# Altium schematic sheet CH32V205CCT-R0.SchDoc
size A3; SheetNumber: 1; SheetTotal: 4
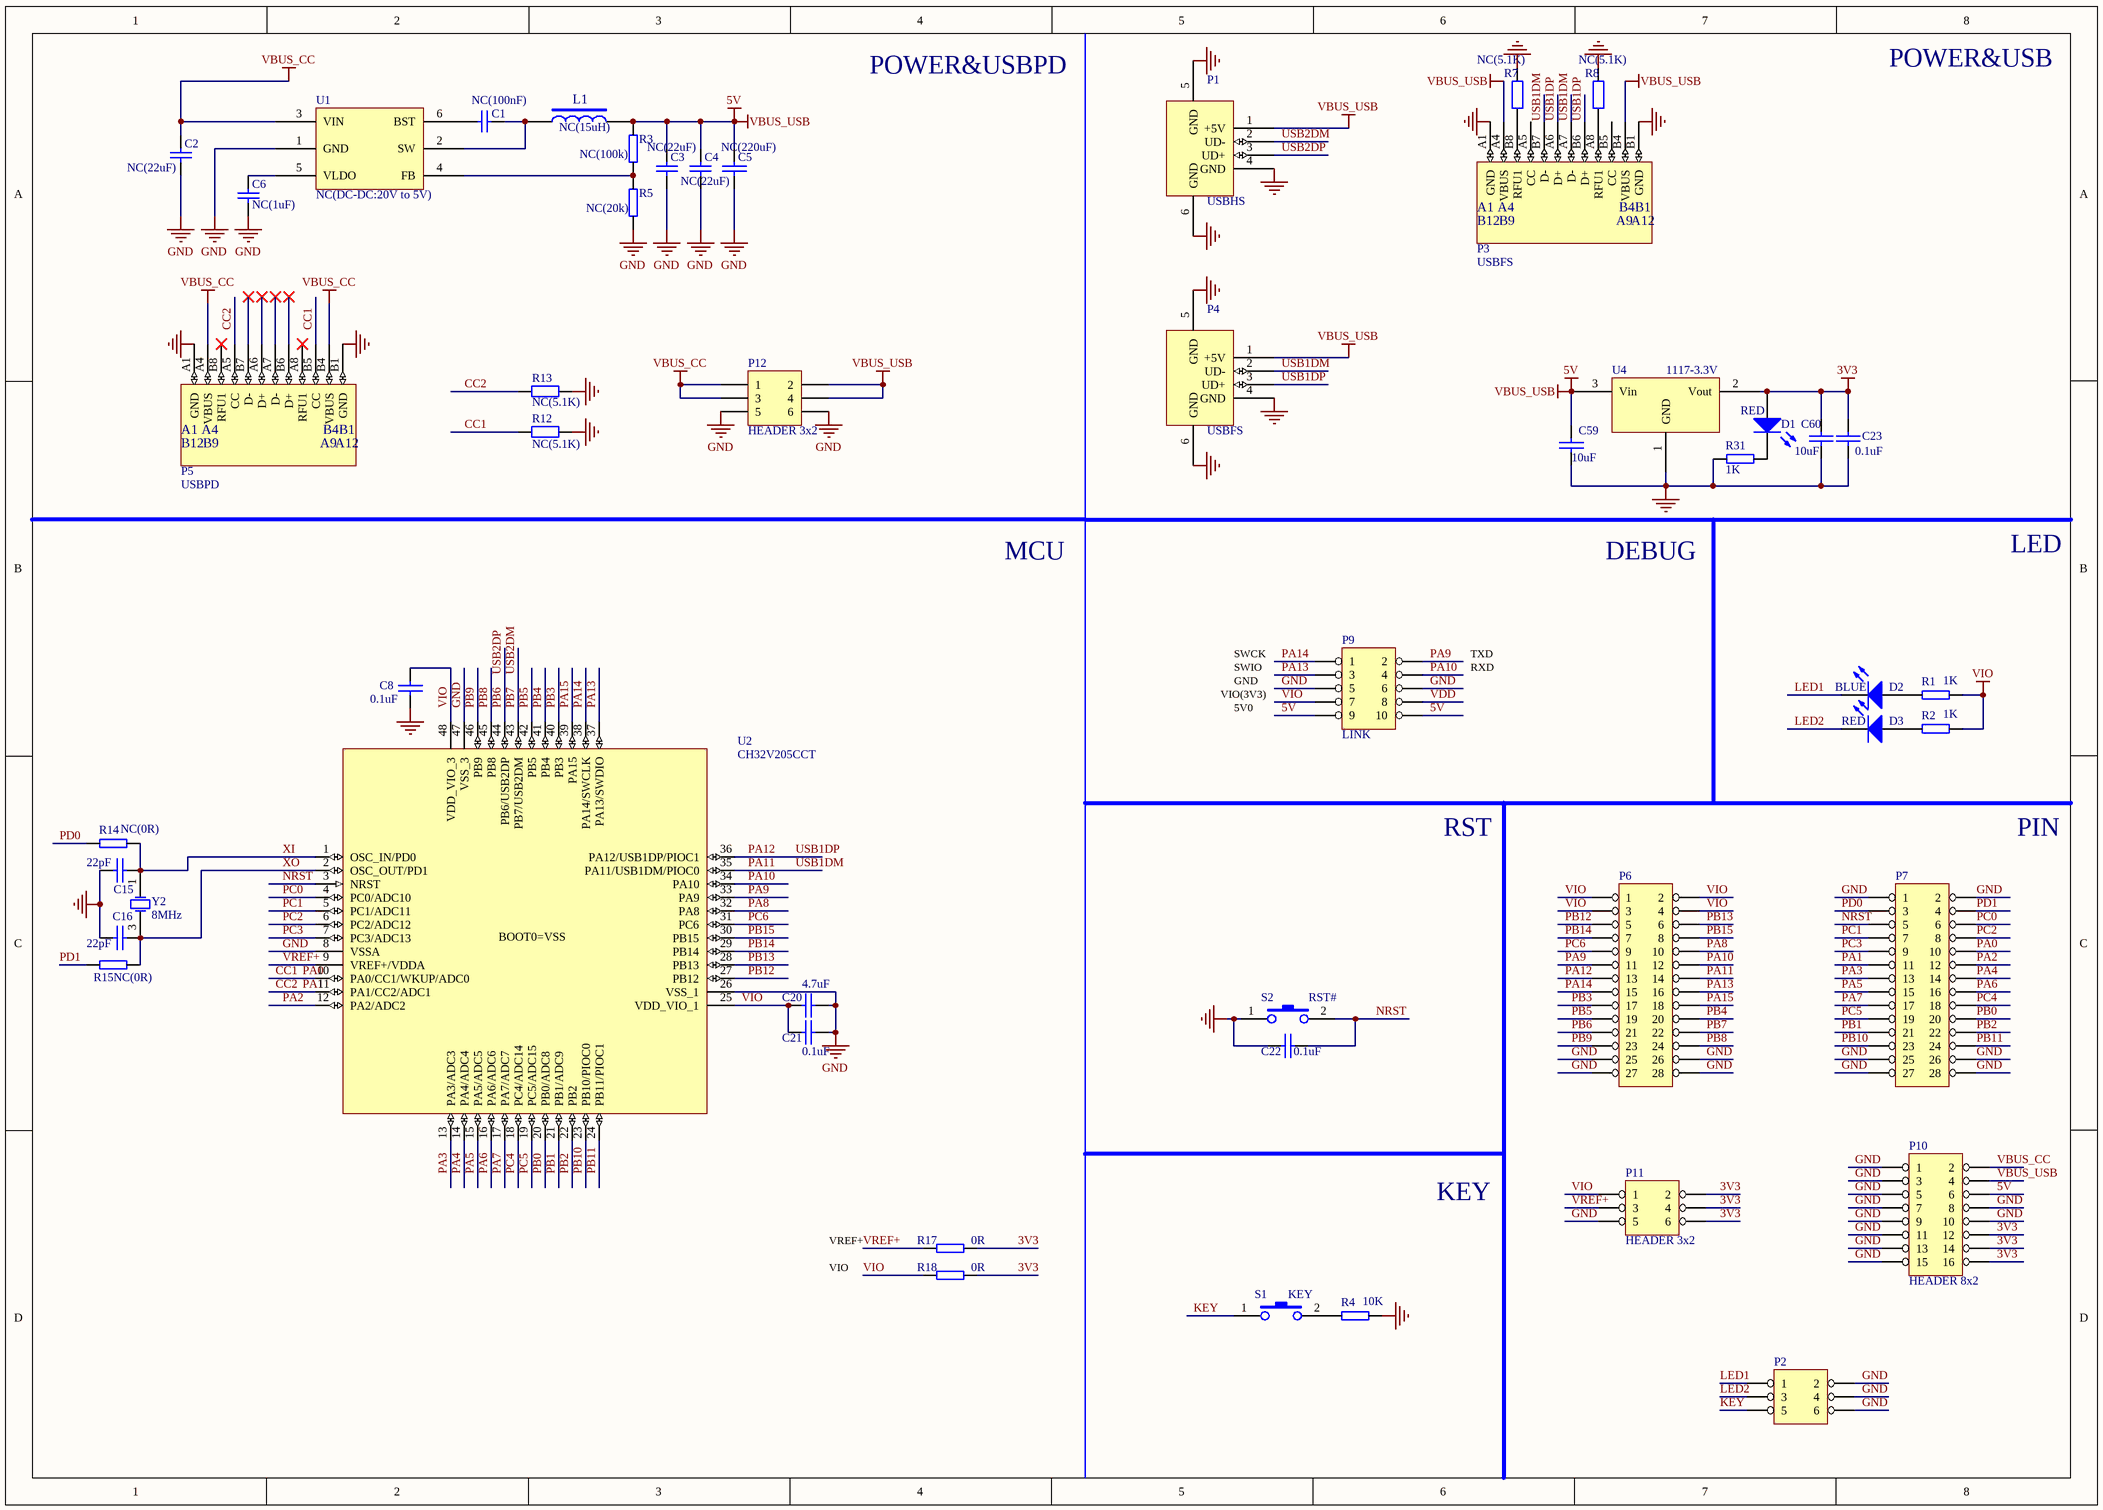
[diagram p0: CH32V205CCT-R0.SchDoc]

## Parts
C1  NC(100nF)  [0402_C]
C2  NC(22uF)  [0805_C]
C3  NC(22uF)  [0805_C]
C4  NC(22uF)  [0805_C]
C5  NC(220uF)  [CD0.1]
C6  NC(1uF)  [0402_C]
C8  0.1uF  [0603_C]
C15  22pF  [0603_C]
C16  22pF  [0603_C]
C20  4.7uF  [0603_C]
C21  0.1uF  [0603_C]
C22  0.1uF  [0603_C]
C23  0.1uF  [0402_C]
C59  10uF  [0603_C]
C60  10uF  [0603_C]
D1  RED  [0603+]
D2  BLUE  [0603+]
D3  RED  [0603+]
L1  NC(15uH)  [SMD_6x6mm]
P1  USBHS  [USBAF]
P2  IO  [IDC6-2.54mm]  (value not drawn)
P3  USBFS  [TYPE-C-Receptacle-2.0]
P4  USBFS  [USBAF]
P5  USBPD  [TYPE-C-Receptacle-2.0]
P6  (no value)  [IDC28-2.54MM]
P7  (no value)  [IDC28-2.54MM]
P9  LINK  [IDC10-2.54mm]
P10  HEADER 8x2  [IDC16-2.54mm]
P11  HEADER 3x2  [IDC6-2.54mm]
P12  HEADER 3x2  [IDC6-2.54mm]
R1  1K  [0603]
R2  1K  [0603]
R3  NC(100k)  [0603]
R4  10K  [0603]
R5  NC(20k)  [0603]
R7  NC(5.1K)  [0402]
R8  NC(5.1K)  [0402]
R12  NC(5.1K)  [0402]
R13  NC(5.1K)  [0402]
R14  NC(0R)  [0603]
R15  NC(0R)  [0603]
R17  0R  [0603]
R18  0R  [0603]
R31  1K  [0402]
S1  KEY  [SMD_6.1x3.65x2.5mm-KEY]
S2  RST#  [SMD_6.1x3.65x2.5mm-KEY]
U1  NC(DC-DC:20V to 5V)
U2  CH32V205CCT  [LQFP48]
U4  1117-3.3V  [SOT-223]
Y2  8MHz  [XT3225]

## Nets
3V3: C23.1 C60.1 D1.1(A) P10.12 P10.14 P10.16 P11.2 P11.4 P11.6 R17.1 R18.1 U4.2(Vout)
5V: C3.2 C4.2 C5.1 C59.1 L1.2 P1.1(+5V) P3.A4(VBUS) P3.B4(VBUS) P4.1(+5V) P9.9 P9.10 P10.4 P10.6 P12.2 P12.4 R3.2 U4.3(Vin)  [also labelled VBUS_USB]
GND: C2.1 C3.1 C4.1 C5.2 C6.1 C8.1 C15.1 C16.1 C20.1 C21.1 C22.1 C23.2 C59.2 C60.2 P1.4(GND) P1.5(GND) P1.6(GND) P2.2 P2.4 P2.6 P3.A1(GND) P3.B1(GND) P4.4(GND) P4.5(GND) P4.6(GND) P5.A1(GND) P5.B1(GND) P6.25 P6.26 P6.27 P6.28 P7.1 P7.2 P7.25 P7.26 P7.27 P7.28 P9.5 P9.6 P10.1 P10.3 P10.5 P10.7 P10.8 P10.9 P10.10 P10.11 P10.13 P10.15 P11.5 P12.5 P12.6 R4.1 R5.1 R7.2 R8.2 R12.2 R13.2 R31.1 S2.1 U1.1(GND) U2.8(VSSA) U2.26(VSS_1) U2.47(VSS_3) U4.1(GND)
VBUS_CC: C2.2 P5.A4(VBUS) P5.B4(VBUS) P10.2 P12.1 P12.3 U1.3(VIN)
VIO: C8.2 C20.2 C21.2 P6.1 P6.2 P6.3 P6.4 P9.7 P11.1 R1.1 R2.1 R18.2 U2.25(VDD_VIO_1) U2.48(VDD_VIO_3)
CC1: P5.B5(CC) P7.10 R12.1 U2.10(PA0/CC1/WKUP/ADC0)  [also labelled PA0]
CC2: P5.A5(CC) P7.11 R13.1 U2.11(PA1/CC2/ADC1)  [also labelled PA1]
KEY: P2.5 S1.1
LED1: D2.2(K) P2.1
LED2: D3.2(K) P2.3
NRST: C22.2 P7.5 S2.2 U2.3(NRST)
PA2: P7.12 U2.12(PA2/ADC2)
PA3: P7.13 U2.13(PA3/ADC3)
PA4: P7.14 U2.14(PA4/ADC4)
PA5: P7.15 U2.15(PA5/ADC5)
PA6: P7.16 U2.16(PA6/ADC6)
PA7: P7.17 U2.17(PA7/ADC7)
PA8: P6.10 U2.32(PA8)
PA9: P6.11 P9.2 U2.33(PA9)
PA10: P6.12 P9.4 U2.34(PA10)
PA11: P3.A7(D-) P3.B7(D-) P4.2(UD-) P6.14 U2.35(PA11/USB1DM/PIOC0)  [also labelled USB1DM]
PA12: P3.A6(D+) P3.B6(D+) P4.3(UD+) P6.13 U2.36(PA12/USB1DP/PIOC1)  [also labelled USB1DP]
PA13: P6.16 P9.3 U2.37(PA13/SWDIO)
PA14: P6.15 P9.1 U2.38(PA14/SWCLK)
PA15: P6.18 U2.39(PA15)
PB0: P7.20 U2.20(PB0/ADC8)
PB1: P7.21 U2.21(PB1/ADC9)
PB2: P7.22 U2.22(PB2)
PB3: P6.17 U2.40(PB3)
PB4: P6.20 U2.41(PB4)
PB5: P6.19 U2.42(PB5)
PB6: P1.3(UD+) P6.21 U2.44(PB6/USB2DP)  [also labelled USB2DP]
PB7: P1.2(UD-) P6.22 U2.43(PB7/USB2DM)  [also labelled USB2DM]
PB8: P6.24 U2.45(PB8)
PB9: P6.23 U2.46(PB9)
PB10: P7.23 U2.23(PB10/PIOC0)
PB11: P7.24 U2.24(PB11/PIOC1)
PB12: P6.5 U2.27(PB12)
PB13: P6.6 U2.28(PB13)
PB14: P6.7 U2.29(PB14)
PB15: P6.8 U2.30(PB15)
PC0: P7.6 U2.4(PC0/ADC10)
PC1: P7.7 U2.5(PC1/ADC11)
PC2: P7.8 U2.6(PC2/ADC12)
PC3: P7.9 U2.7(PC3/ADC13)
PC4: P7.18 U2.18(PC4/ADC14)
PC5: P7.19 U2.19(PC5/ADC15)
PC6: P6.9 U2.31(PC6)
PD0: P7.3 R14.1
PD1: P7.4 R15.1
VDD: P9.8
VREF+: P11.3 R17.2 U2.9(VREF+/VDDA)
XI: C15.2 R14.2 U2.1(OSC_IN/PD0) Y2.1(OSC1)
XO: C16.2 R15.2 U2.2(OSC_OUT/PD1) Y2.3(OSC2)
NetC1_1: C1.1 L1.1 U1.2(SW)
NetC1_2: C1.2 U1.6(BST)
NetC6_2: C6.2 U1.5(VLDO)
NetD1_2: D1.2(K) R31.2
NetD2_1: D2.1(A) R1.2
NetD3_1: D3.1(A) R2.2
NetP3_A8: P3.A8(RFU1) R8.1
NetP3_B8: P3.B8(RFU1) R7.1
NetR3_1: R3.1 R5.2 U1.4(FB)
NetR4_2: R4.2 S1.2

Not connected (* = marked no-connect by the designer): P3 A5(CC) B5(CC); P5 A6(D+)* A7(D-)* A8(RFU1)* B6(D+)* B7(D-)* B8(RFU1)*

## Notes on the sheet
- POWER&USBPD
- POWER&USB
- MCU
- DEBUG
- LED
- VIO(3V3)
- SWCK
- SWIO
- 5V0
- GND
- TXD
- RXD
- RST
- PIN
- VREF+
- KEY
- VIO
- (in symbol CH32V205CCT) BOOT0=VSS
- (in symbol TYPE-C1) B12; B9; A9; A12

## Library data of the parts
C1-C4 C6 = 0603 100nF (104) 10% 50V: 贴片电容; ComponentLink1Description: 供应商链接; ComponentLink1URL: http://www.szlcsc.com/product/details_15331.html; Package: 0603; Supplier: LC; SuppliersPartNumber: C14663
C5 C8 C15 C16 C20-C23 C59 C60 = CAP: Capacitor
D1-D3 = LED0: Typical INFRARED GaAs LED; Published: 8-Jun-2000; LatestRevisionDate: 08-Jul-2005; LatestRevisionNote: Mech Layer 1 removed.; PackageReference: LED-0; Publisher: Altium Limited; PackageDescription: LED; 2 Leads
L1 = INDUCTOR
P1 P4 = USB: USB Port
P2 P11 P12 = HEADER 3x2: Header, 3-Pin, Dual row
P3 P5 = TYPE-C1
P6 P7 = HEADER 14x2: Header, 14-Pin, Dual row
P9 = HEADER 5x2: Header, 5-Pin, Dual row
P10 = HEADER 8x2: Header, 8-Pin, Dual row
R1-R5 R14 R15 R31 = RES
R7 R8 R12 R13 = Res2: Resistor
R17 R18 = R
S1 S2 = KEY1
U1 = TPS54202: DCDC
U2 = CH32V205CCT: RISC-V MCU, 192MHz, USB_480M, USB FS, PD, PIOC, ADC, TKEY, 2*OPA, 2*CMP
Y2 = XTAL: Crystal Oscillator; Published: 8-Jun-2000; LatestRevisionDate: 17-Jul-2002; LatestRevisionNote: Re-released for DXP Platform.; PackageReference: R38; Publisher: Altium Limited; PackageDescription: Crystal, Thru-Hole; 2 Leads; Body 3.1 x 8.2 mm (Dia.xH)